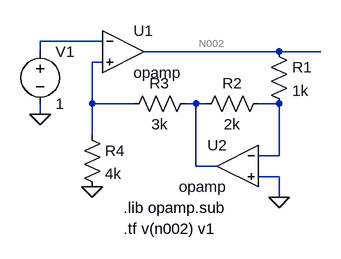
[diagram p0: schematic pag7es16.asc]
pag7es16.asc, the LTspice schematic file:
Version 4
SHEET 1 880 680
WIRE 96 32 0 32
WIRE 0 48 0 32
WIRE 368 48 160 48
WIRE 432 48 368 48
WIRE 96 64 80 64
WIRE 80 128 80 64
WIRE 144 128 80 128
WIRE 240 128 224 128
WIRE 256 128 240 128
WIRE 368 128 336 128
WIRE 0 144 0 128
WIRE 80 176 80 128
WIRE 368 208 368 128
WIRE 368 208 336 208
WIRE 240 224 240 128
WIRE 272 224 240 224
WIRE 368 240 336 240
WIRE 368 272 368 240
FLAG 0 144 0
FLAG 80 256 0
FLAG 368 272 0
SYMBOL OpAmps\\opamp 128 -16 R0
SYMATTR InstName U1
SYMBOL OpAmps\\opamp 304 160 M0
SYMATTR InstName U2
SYMBOL voltage 0 32 R0
SYMATTR InstName V1
SYMATTR Value 1
SYMBOL res 64 160 R0
SYMATTR InstName R4
SYMATTR Value 4k
SYMBOL res 240 112 R90
WINDOW 0 0 56 VBottom 2
WINDOW 3 32 56 VTop 2
SYMATTR InstName R3
SYMATTR Value 3k
SYMBOL res 352 32 R0
SYMATTR InstName R1
SYMATTR Value 1k
SYMBOL res 352 112 R90
WINDOW 0 0 56 VBottom 2
WINDOW 3 32 56 VTop 2
SYMATTR InstName R2
SYMATTR Value 2k
TEXT 128 288 Left 2 !.lib opamp.sub
TEXT 128 320 Left 2 !.tf v(n002) v1

The netlist it stands for:
* pag7es16.asc
XU1 N001 N003 N002 opamp Aol=100K GBW=10Meg  ; pins invin noninvin out
XU2 N005 0 N004 opamp Aol=100K GBW=10Meg  ; pins invin noninvin out
V1 N001 0 1
R4 N003 0 4k
R3 N004 N003 3k
R1 N002 N005 1k
R2 N005 N004 2k
.lib opamp.sub
.tf v(n002) v1
.backanno
.end